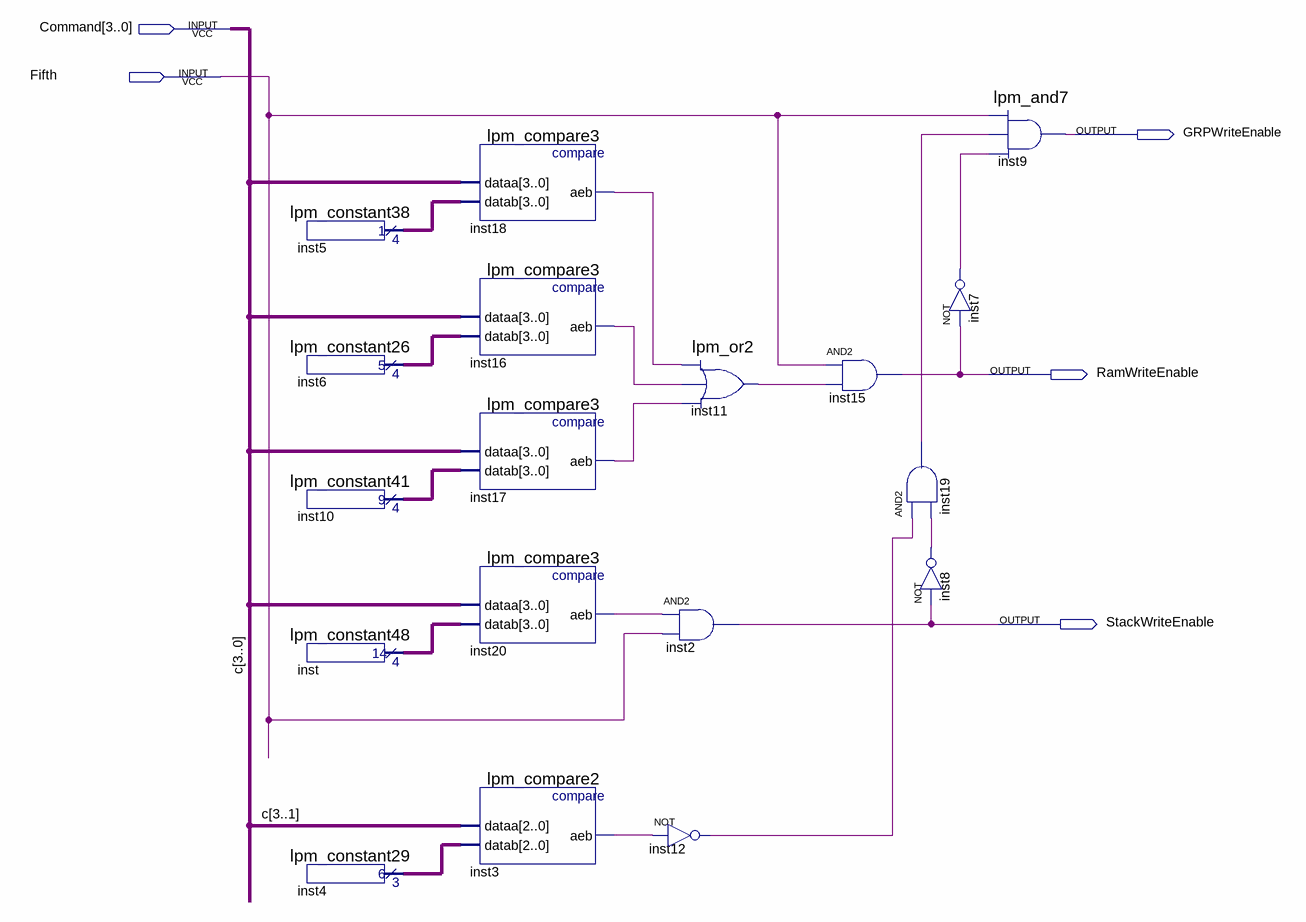
[diagram p0: schematic sheet]
// Quartus schematic WriteEnableBlock.bdf as structural Verilog: 18 symbols, 5 pins
module WriteEnableBlock (
  input  [3:0] Command,
  input  Fifth,
  output GRPWriteEnable,
  output RamWriteEnable,
  output StackWriteEnable
);

  wire inst3_aeb, inst7_out, inst8_out, inst11_result, inst12_out, inst16_aeb, inst17_aeb, inst18_aeb,
       inst19_out, inst20_aeb;
  wire [2:0] inst4_result;
  wire [3:0] inst5_result, inst6_result, inst10_result, inst_result;

  lpm_constant38 inst5 (.result(inst5_result));
  lpm_constant26 inst6 (.result(inst6_result));
  lpm_constant41 inst10 (.result(inst10_result));
  lpm_constant48 inst (.result(inst_result));
  lpm_constant29 inst4 (.result(inst4_result));
  lpm_compare3 inst18 (.dataa(Command), .datab(inst5_result), .aeb(inst18_aeb));
  lpm_compare3 inst16 (.dataa(Command), .datab(inst6_result), .aeb(inst16_aeb));
  lpm_compare3 inst17 (.dataa(Command), .datab(inst10_result), .aeb(inst17_aeb));
  lpm_compare3 inst20 (.dataa(Command), .datab(inst_result), .aeb(inst20_aeb));
  lpm_compare2 inst3 (.dataa(Command[3:1]), .datab(inst4_result), .aeb(inst3_aeb));
  lpm_or2 inst11 (.data0(inst18_aeb), .data1(inst16_aeb), .data2(inst17_aeb), .result(inst11_result));
  and inst2 (StackWriteEnable, inst20_aeb, Fifth);
  not inst12 (inst12_out, inst3_aeb);
  and inst15 (RamWriteEnable, Fifth, inst11_result);
  and inst19 (inst19_out, inst12_out, inst8_out);
  not inst8 (inst8_out, StackWriteEnable);
  lpm_and7 inst9 (.data0(Fifth), .data1(inst19_out), .data2(inst7_out), .result(GRPWriteEnable));
  not inst7 (inst7_out, RamWriteEnable);

  // Other names for the same wires on the sheet: c[3:0] = Command
endmodule
